# EAGLE design 16n-midijack (EAGLE 8.5.0)

## Sheet 1 of 2: Faders / Jacks / Digital
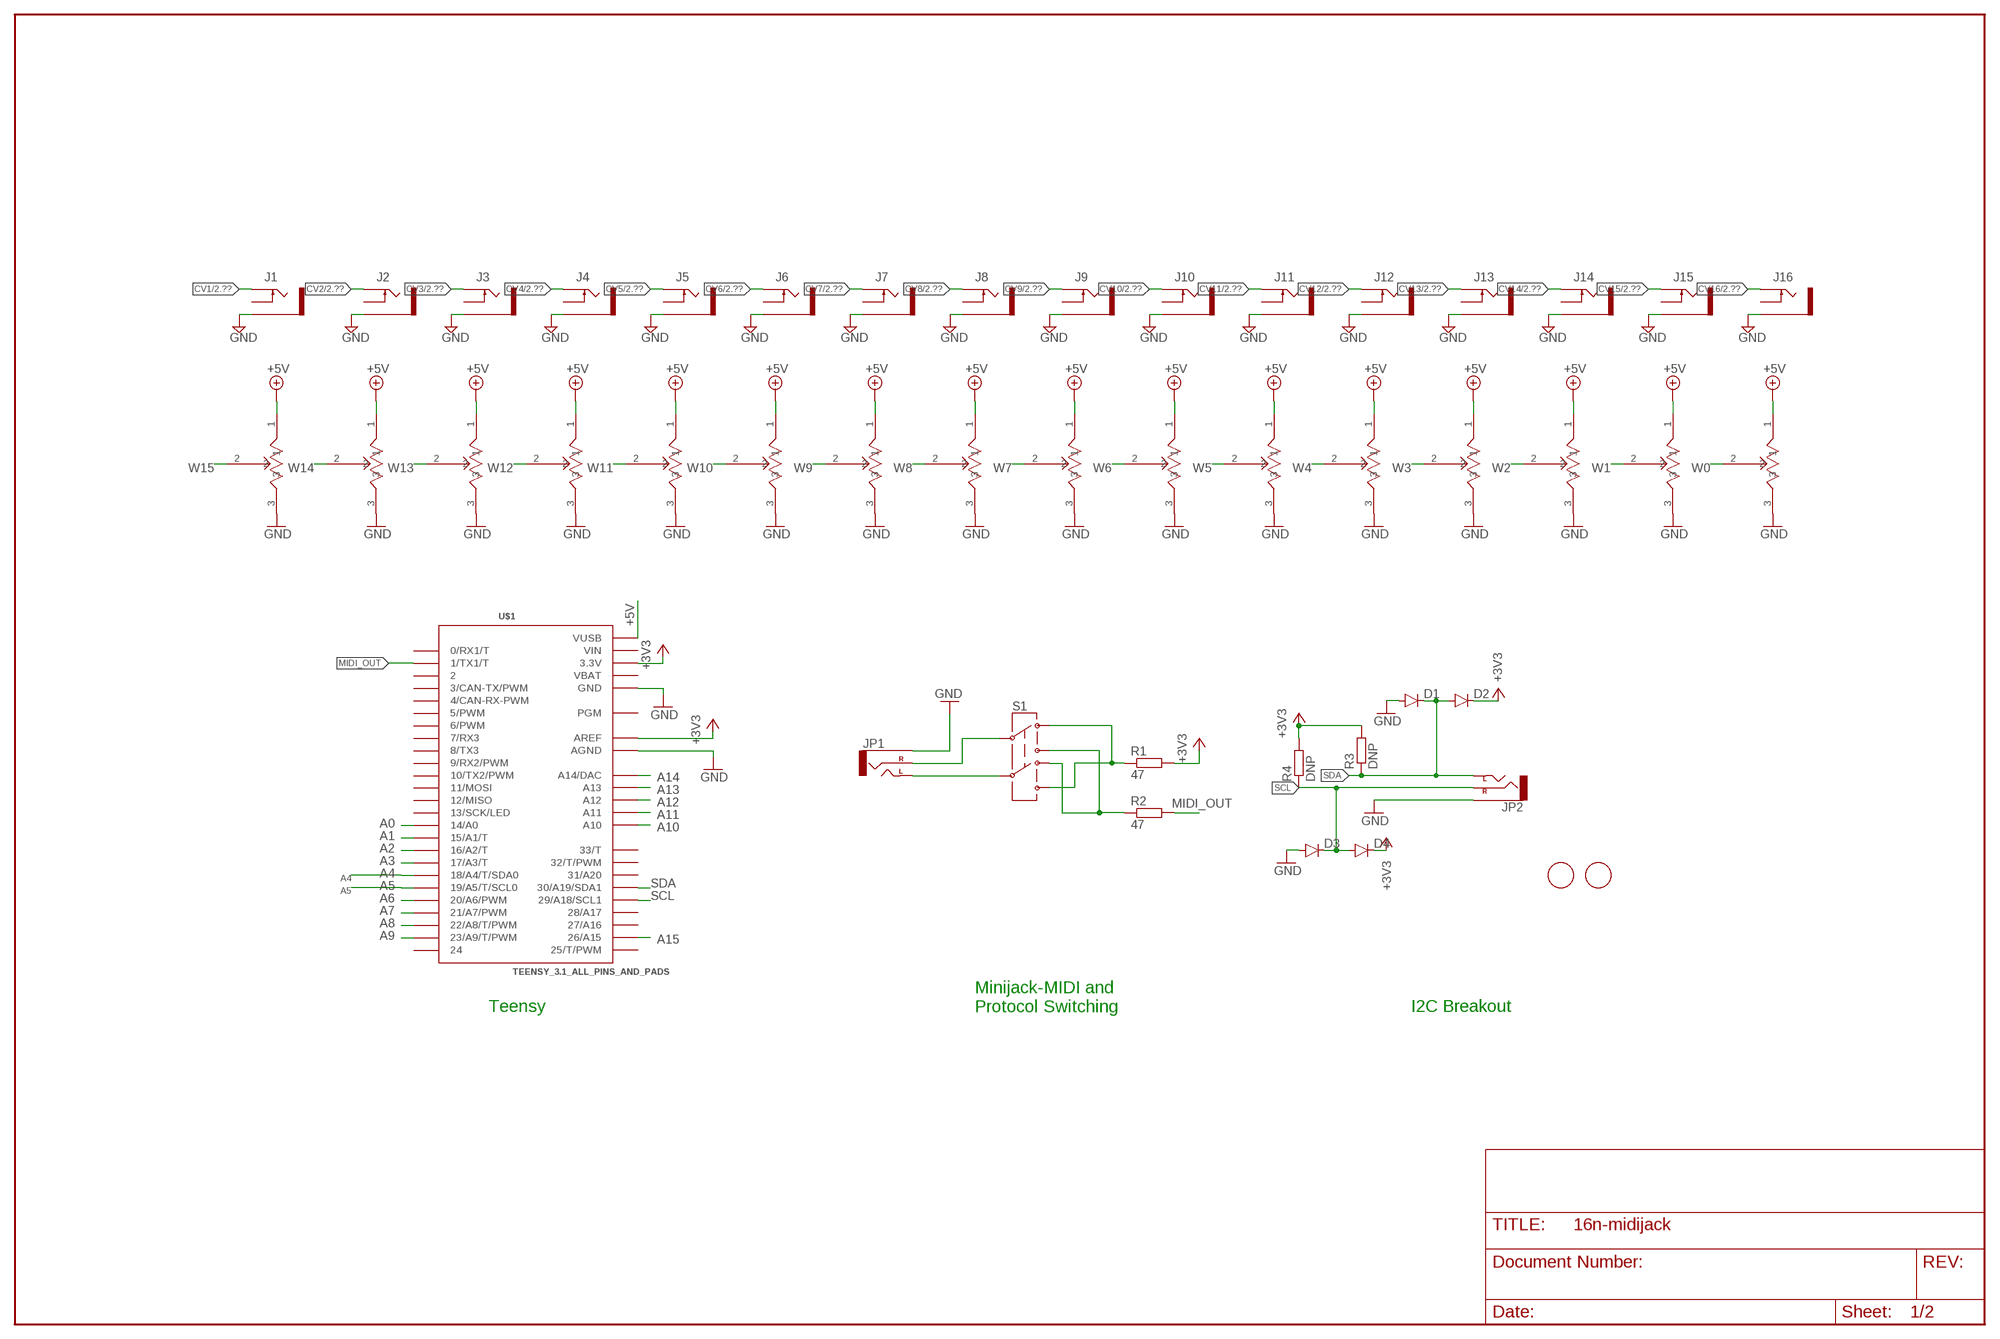
[diagram p0: schematic, sheet 1]

### Parts
D1  DIODESOD123  [SOD-123]
D2  DIODESOD123  [SOD-123]
D3  DIODESOD123  [SOD-123]
D4  DIODESOD123  [SOD-123]
FID1  FIDUCIAL  [FIDUCIAL_1MM]
FID2  FIDUCIAL  [FIDUCIAL_1MM]
J1  PJ302M  [PJ302M]
J2  PJ302M  [PJ302M]
J3  PJ302M  [PJ302M]
J4  PJ302M  [PJ302M]
J5  PJ302M  [PJ302M]
J6  PJ302M  [PJ302M]
J7  PJ302M  [PJ302M]
J8  PJ302M  [PJ302M]
J9  PJ302M  [PJ302M]
J10  PJ302M  [PJ302M]
J11  PJ302M  [PJ302M]
J12  PJ302M  [PJ302M]
J13  PJ302M  [PJ302M]
J14  PJ302M  [PJ302M]
J15  PJ302M  [PJ302M]
J16  PJ302M  [PJ302M]
JP1  AUDIO-JACKPTH  [AUDIO-JACK]
JP2  AUDIO-JACKPTH  [AUDIO-JACK]
R1  47  R-EU_R0805  [R0805]
R2  47  R-EU_R0805  [R0805]
R3  DNP  R-EU_R0805  [R0805]
R4  DNP  R-EU_R0805  [R0805]
S1  SWITCH-DPDTEG2211  [EG2211]
U$1  TEENSY_3.1_ALL_PINS_AND_PADS  [TEENSY_3.1_ALLPINS]
U$2  SLIDEPOT-ALPS-60MM  [RS6011SP600]
U$3  SLIDEPOT-ALPS-60MM  [RS6011SP600]
U$4  SLIDEPOT-ALPS-60MM  [RS6011SP600]
U$5  SLIDEPOT-ALPS-60MM  [RS6011SP600]
U$6  SLIDEPOT-ALPS-60MM  [RS6011SP600]
U$7  SLIDEPOT-ALPS-60MM  [RS6011SP600]
U$8  SLIDEPOT-ALPS-60MM  [RS6011SP600]
U$9  SLIDEPOT-ALPS-60MM  [RS6011SP600]
U$10  SLIDEPOT-ALPS-60MM  [RS6011SP600]
U$11  SLIDEPOT-ALPS-60MM  [RS6011SP600]
U$12  SLIDEPOT-ALPS-60MM  [RS6011SP600]
U$13  SLIDEPOT-ALPS-60MM  [RS6011SP600]
U$14  SLIDEPOT-ALPS-60MM  [RS6011SP600]
U$15  SLIDEPOT-ALPS-60MM  [RS6011SP600]
U$16  SLIDEPOT-ALPS-60MM  [RS6011SP600]
U$17  SLIDEPOT-ALPS-60MM  [RS6011SP600]

### Nets
+3V3: D2.C D4.C R1.2 R3.2 R4.2 U$1.3.3V U$1.3.3V1(3.3V) U$1.3.3V2(3.3V) U$1.AREF
+5V: U$1.VUSB U$2.1 U$3.1 U$4.1 U$5.1 U$6.1 U$7.1 U$8.1 U$9.1 U$10.1 U$11.1 U$12.1 U$13.1 U$14.1 U$15.1 U$16.1 U$17.1 ; also sheet 2
A0: U$1.14/A0 ; also sheet 2
A1: U$1.15/A1(15/A1/T) ; also sheet 2
A2: U$1.16/A2(16/A2/T) ; also sheet 2
A3: U$1.17/A3(17/A3/T) ; also sheet 2
A4: U$1.18/A4(18/A4/T/SDA0) ; also sheet 2
A5: U$1.19/A5(19/A5/T/SCL0) ; also sheet 2
A6: U$1.20/A6(20/A6/PWM) ; also sheet 2
A7: U$1.21/A7(21/A7/PWM) ; also sheet 2
A8: U$1.22/A8(22/A8/T/PWM) ; also sheet 2
A9: U$1.23/A9(23/A9/T/PWM) ; also sheet 2
A10: U$1.A10 ; also sheet 2
A11: U$1.A11 ; also sheet 2
A12: U$1.A12 ; also sheet 2
A13: U$1.A13 ; also sheet 2
A14: U$1.A14(A14/DAC) ; also sheet 2
A15: U$1.26(26/A15) ; also sheet 2
CV1: J1.TIP ; also sheet 2
CV2: J2.TIP ; also sheet 2
CV3: J3.TIP ; also sheet 2
CV4: J4.TIP ; also sheet 2
CV5: J5.TIP ; also sheet 2
CV6: J6.TIP ; also sheet 2
CV7: J7.TIP ; also sheet 2
CV8: J8.TIP ; also sheet 2
CV9: J9.TIP ; also sheet 2
CV10: J10.TIP ; also sheet 2
CV11: J11.TIP ; also sheet 2
CV12: J12.TIP ; also sheet 2
CV13: J13.TIP ; also sheet 2
CV14: J14.TIP ; also sheet 2
CV15: J15.TIP ; also sheet 2
CV16: J16.TIP ; also sheet 2
GND: D1.A D3.A J1.GND(SLEEVE) J2.GND(SLEEVE) J3.GND(SLEEVE) J4.GND(SLEEVE) J5.GND(SLEEVE) J6.GND(SLEEVE) J7.GND(SLEEVE) J8.GND(SLEEVE) J9.GND(SLEEVE) J10.GND(SLEEVE) J11.GND(SLEEVE) J12.GND(SLEEVE) J13.GND(SLEEVE) J14.GND(SLEEVE) J15.GND(SLEEVE) J16.GND(SLEEVE) JP1.SLEEVE JP2.SLEEVE U$1.AGND U$1.GND U$1.GND1(GND) U$1.GND2(GND) U$2.3 U$3.3 U$4.3 U$5.3 U$6.3 U$7.3 U$8.3 U$9.3 U$10.3 U$11.3 U$12.3 U$13.3 U$14.3 U$15.3 U$16.3 U$17.3 ; also sheet 2
MIDI_OUT: R2.2 U$1.1(1/TX1/T)
N$1: JP1.TIP(LEFT) S1.P2
N$2: JP1.RING(RIGHT) S1.P1
N$3: R2.1 S1.P1-TB S1.P2-TA
N$4: R1.1 S1.P1-TA S1.P2-TB
SCL: D3.C D4.A JP2.RING(RIGHT) R4.1 U$1.29(29/A18/SCL1)
SDA: D1.C D2.A JP2.TIP(LEFT) R3.1 U$1.30(30/A19/SDA1)
W0: U$17.2 ; also sheet 2
W1: U$16.2 ; also sheet 2
W2: U$15.2 ; also sheet 2
W3: U$14.2 ; also sheet 2
W4: U$13.2 ; also sheet 2
W5: U$12.2 ; also sheet 2
W6: U$11.2 ; also sheet 2
W7: U$10.2 ; also sheet 2
W8: U$9.2 ; also sheet 2
W9: U$8.2 ; also sheet 2
W10: U$7.2 ; also sheet 2
W11: U$6.2 ; also sheet 2
W12: U$5.2 ; also sheet 2
W13: U$4.2 ; also sheet 2
W14: U$3.2 ; also sheet 2
W15: U$2.2 ; also sheet 2
Unconnected: J1.SW(SWITCH) J2.SW(SWITCH) J3.SW(SWITCH) J4.SW(SWITCH) J5.SW(SWITCH) J6.SW(SWITCH) J7.SW(SWITCH) J8.SW(SWITCH) J9.SW(SWITCH) J10.SW(SWITCH) J11.SW(SWITCH) J12.SW(SWITCH) J13.SW(SWITCH) J14.SW(SWITCH) J15.SW(SWITCH) J16.SW(SWITCH) U$1.0(0/RX1/T) U$1.2 U$1.3(3/CAN-TX/PWM) U$1.4(4/CAN-RX-PWM) U$1.5(5/PWM) U$1.6(6/PWM) U$1.7(7/RX3) U$1.8(8/TX3) U$1.9(9/RX2/PWM) U$1.10(10/TX2/PWM) U$1.11(11/MOSI) U$1.12(12/MISO) U$1.13(13/SCK/LED) U$1.24 U$1.25(25/T/PWM) U$1.27(27/A16) U$1.28(28/A17) U$1.31(31/A20) U$1.32(32/T/PWM) U$1.33(33/T) U$1.PGM

### Notes on the sheet
- Teensy
- Minijack-MIDI and 
  Protocol Switching
- I2C Breakout

## Sheet 2 of 2: Buffers / OpAmp power
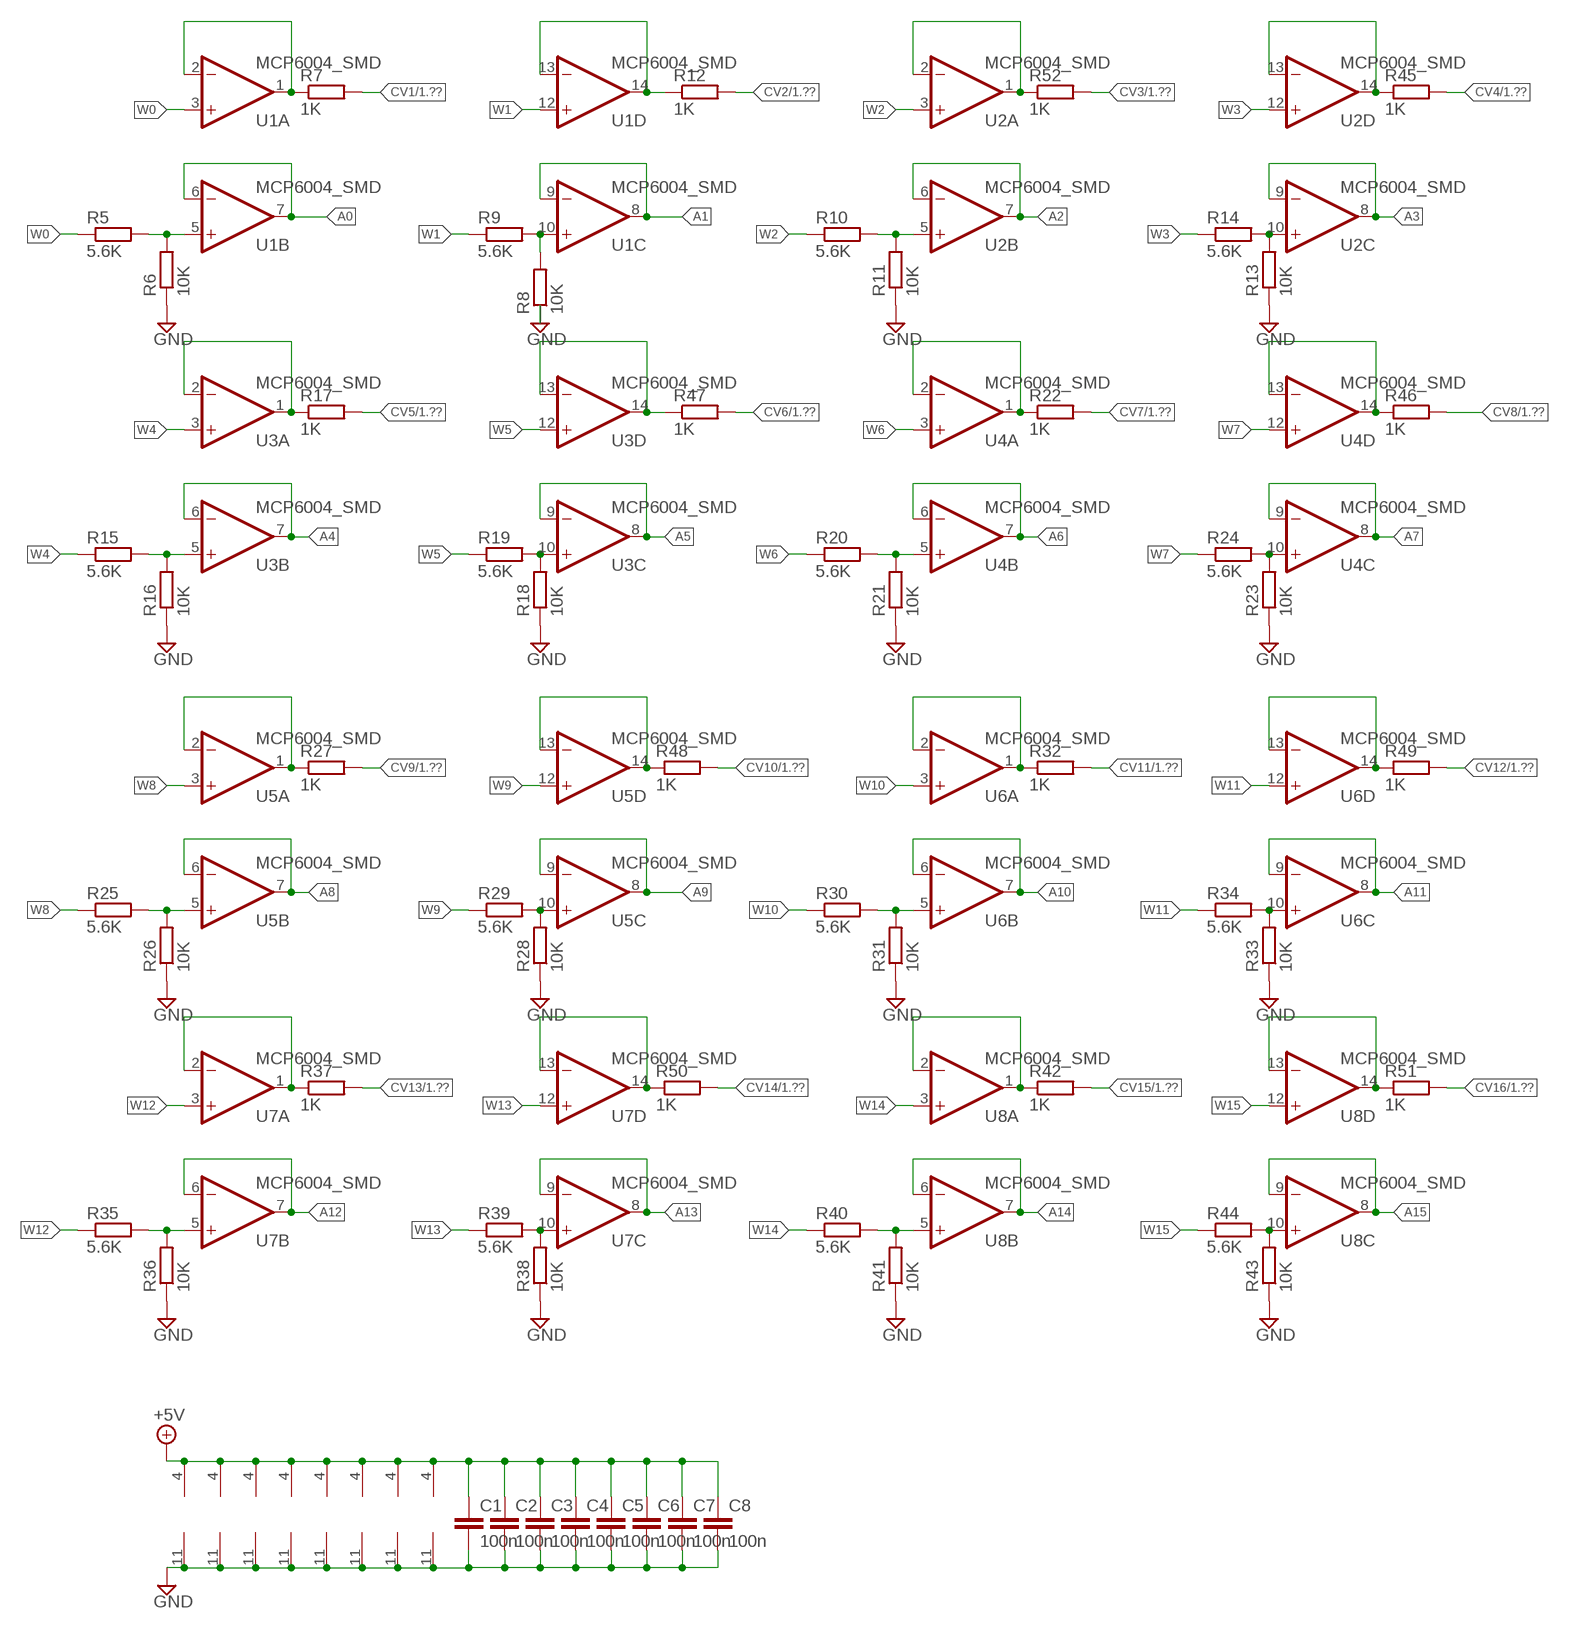
[diagram p1: schematic, sheet 2]

### Parts
C1  100n  C-EUC0805  [C0805]
C2  100n  C-EUC0805  [C0805]
C3  100n  C-EUC0805  [C0805]
C4  100n  C-EUC0805  [C0805]
C5  100n  C-EUC0805  [C0805]
C6  100n  C-EUC0805  [C0805]
C7  100n  C-EUC0805  [C0805]
C8  100n  C-EUC0805  [C0805]
R5  5.6K  R-EU_R0805  [R0805]
R6  10K  R-EU_R0805  [R0805]
R7  1K  R-EU_R0805  [R0805]
R8  10K  R-EU_R0805  [R0805]
R9  5.6K  R-EU_R0805  [R0805]
R10  5.6K  R-EU_R0805  [R0805]
R11  10K  R-EU_R0805  [R0805]
R12  1K  R-EU_R0805  [R0805]
R13  10K  R-EU_R0805  [R0805]
R14  5.6K  R-EU_R0805  [R0805]
R15  5.6K  R-EU_R0805  [R0805]
R16  10K  R-EU_R0805  [R0805]
R17  1K  R-EU_R0805  [R0805]
R18  10K  R-EU_R0805  [R0805]
R19  5.6K  R-EU_R0805  [R0805]
R20  5.6K  R-EU_R0805  [R0805]
R21  10K  R-EU_R0805  [R0805]
R22  1K  R-EU_R0805  [R0805]
R23  10K  R-EU_R0805  [R0805]
R24  5.6K  R-EU_R0805  [R0805]
R25  5.6K  R-EU_R0805  [R0805]
R26  10K  R-EU_R0805  [R0805]
R27  1K  R-EU_R0805  [R0805]
R28  10K  R-EU_R0805  [R0805]
R29  5.6K  R-EU_R0805  [R0805]
R30  5.6K  R-EU_R0805  [R0805]
R31  10K  R-EU_R0805  [R0805]
R32  1K  R-EU_R0805  [R0805]
R33  10K  R-EU_R0805  [R0805]
R34  5.6K  R-EU_R0805  [R0805]
R35  5.6K  R-EU_R0805  [R0805]
R36  10K  R-EU_R0805  [R0805]
R37  1K  R-EU_R0805  [R0805]
R38  10K  R-EU_R0805  [R0805]
R39  5.6K  R-EU_R0805  [R0805]
R40  5.6K  R-EU_R0805  [R0805]
R41  10K  R-EU_R0805  [R0805]
R42  1K  R-EU_R0805  [R0805]
R43  10K  R-EU_R0805  [R0805]
R44  5.6K  R-EU_R0805  [R0805]
R45  1K  R-EU_R0805  [R0805]
R46  1K  R-EU_R0805  [R0805]
R47  1K  R-EU_R0805  [R0805]
R48  1K  R-EU_R0805  [R0805]
R49  1K  R-EU_R0805  [R0805]
R50  1K  R-EU_R0805  [R0805]
R51  1K  R-EU_R0805  [R0805]
R52  1K  R-EU_R0805  [R0805]
U1  MCP6004_SMD  [SO14]
U2  MCP6004_SMD  [SO14]
U3  MCP6004_SMD  [SO14]
U4  MCP6004_SMD  [SO14]
U5  MCP6004_SMD  [SO14]
U6  MCP6004_SMD  [SO14]
U7  MCP6004_SMD  [SO14]
U8  MCP6004_SMD  [SO14]

### Nets
+5V: C1.1 C2.1 C3.1 C4.1 C5.1 C6.1 C7.1 C8.1 U1.4(P:V+) U2.4(P:V+) U3.4(P:V+) U4.4(P:V+) U5.4(P:V+) U6.4(P:V+) U7.4(P:V+) U8.4(P:V+) ; also sheet 1
A0: U1.6(B:-IN) U1.7(B:OUT) ; also sheet 1
A1: U1.8(C:OUT) U1.9(C:-IN) ; also sheet 1
A2: U2.6(B:-IN) U2.7(B:OUT) ; also sheet 1
A3: U2.8(C:OUT) U2.9(C:-IN) ; also sheet 1
A4: U3.6(B:-IN) U3.7(B:OUT) ; also sheet 1
A5: U3.8(C:OUT) U3.9(C:-IN) ; also sheet 1
A6: U4.6(B:-IN) U4.7(B:OUT) ; also sheet 1
A7: U4.8(C:OUT) U4.9(C:-IN) ; also sheet 1
A8: U5.6(B:-IN) U5.7(B:OUT) ; also sheet 1
A9: U5.8(C:OUT) U5.9(C:-IN) ; also sheet 1
A10: U6.6(B:-IN) U6.7(B:OUT) ; also sheet 1
A11: U6.8(C:OUT) U6.9(C:-IN) ; also sheet 1
A12: U7.6(B:-IN) U7.7(B:OUT) ; also sheet 1
A13: U7.8(C:OUT) U7.9(C:-IN) ; also sheet 1
A14: U8.6(B:-IN) U8.7(B:OUT) ; also sheet 1
A15: U8.8(C:OUT) U8.9(C:-IN) ; also sheet 1
CV1: R7.2 ; also sheet 1
CV2: R12.2 ; also sheet 1
CV3: R52.2 ; also sheet 1
CV4: R45.2 ; also sheet 1
CV5: R17.2 ; also sheet 1
CV6: R47.2 ; also sheet 1
CV7: R22.2 ; also sheet 1
CV8: R46.2 ; also sheet 1
CV9: R27.2 ; also sheet 1
CV10: R48.2 ; also sheet 1
CV11: R32.2 ; also sheet 1
CV12: R49.2 ; also sheet 1
CV13: R37.2 ; also sheet 1
CV14: R50.2 ; also sheet 1
CV15: R42.2 ; also sheet 1
CV16: R51.2 ; also sheet 1
GND: C1.2 C2.2 C3.2 C4.2 C5.2 C6.2 C7.2 C8.2 R6.1 R8.1 R11.1 R13.1 R16.1 R18.1 R21.1 R23.1 R26.1 R28.1 R31.1 R33.1 R36.1 R38.1 R41.1 R43.1 U1.11(P:V-) U2.11(P:V-) U3.11(P:V-) U4.11(P:V-) U5.11(P:V-) U6.11(P:V-) U7.11(P:V-) U8.11(P:V-) ; also sheet 1
N$6: R10.2 R11.2 U2.5(B:+IN)
N$7: R13.2 R14.2 U2.10(C:+IN)
N$9: R5.2 R6.2 U1.5(B:+IN)
N$10: R8.2 R9.2 U1.10(C:+IN)
N$12: R15.2 R16.2 U3.5(B:+IN)
N$13: R18.2 R19.2 U3.10(C:+IN)
N$15: R20.2 R21.2 U4.5(B:+IN)
N$16: R23.2 R24.2 U4.10(C:+IN)
N$18: R25.2 R26.2 U5.5(B:+IN)
N$19: R28.2 R29.2 U5.10(C:+IN)
N$21: R30.2 R31.2 U6.5(B:+IN)
N$22: R33.2 R34.2 U6.10(C:+IN)
N$24: R35.2 R36.2 U7.5(B:+IN)
N$25: R38.2 R39.2 U7.10(C:+IN)
N$27: R40.2 R41.2 U8.5(B:+IN)
N$28: R43.2 R44.2 U8.10(C:+IN)
N$300: R7.1 U1.1(A:OUT) U1.2(A:-IN)
N$301: R12.1 U1.13(D:-IN) U1.14(D:OUT)
N$302: R52.1 U2.1(A:OUT) U2.2(A:-IN)
N$303: R45.1 U2.13(D:-IN) U2.14(D:OUT)
N$304: R17.1 U3.1(A:OUT) U3.2(A:-IN)
N$305: R47.1 U3.13(D:-IN) U3.14(D:OUT)
N$306: R22.1 U4.1(A:OUT) U4.2(A:-IN)
N$307: R46.1 U4.13(D:-IN) U4.14(D:OUT)
N$308: R27.1 U5.1(A:OUT) U5.2(A:-IN)
N$309: R48.1 U5.13(D:-IN) U5.14(D:OUT)
N$310: R32.1 U6.1(A:OUT) U6.2(A:-IN)
N$311: R49.1 U6.13(D:-IN) U6.14(D:OUT)
N$312: R37.1 U7.1(A:OUT) U7.2(A:-IN)
N$313: R50.1 U7.13(D:-IN) U7.14(D:OUT)
N$314: R42.1 U8.1(A:OUT) U8.2(A:-IN)
N$315: R51.1 U8.13(D:-IN) U8.14(D:OUT)
W0: R5.1 U1.3(A:+IN) ; also sheet 1
W1: R9.1 U1.12(D:+IN) ; also sheet 1
W2: R10.1 U2.3(A:+IN) ; also sheet 1
W3: R14.1 U2.12(D:+IN) ; also sheet 1
W4: R15.1 U3.3(A:+IN) ; also sheet 1
W5: R19.1 U3.12(D:+IN) ; also sheet 1
W6: R20.1 U4.3(A:+IN) ; also sheet 1
W7: R24.1 U4.12(D:+IN) ; also sheet 1
W8: R25.1 U5.3(A:+IN) ; also sheet 1
W9: R29.1 U5.12(D:+IN) ; also sheet 1
W10: R30.1 U6.3(A:+IN) ; also sheet 1
W11: R34.1 U6.12(D:+IN) ; also sheet 1
W12: R35.1 U7.3(A:+IN) ; also sheet 1
W13: R39.1 U7.12(D:+IN) ; also sheet 1
W14: R40.1 U8.3(A:+IN) ; also sheet 1
W15: R44.1 U8.12(D:+IN) ; also sheet 1

## Power pins joined to a net without a drawn wire
VBAT: U$1.VBAT
VIN: U$1.VIN

## Library data of the parts
C1-C8 = rcl:C-EU: CAPACITOR, European symbol
D1-D4 = foxfield:DIODE
FID1 FID2 = adafruit:FIDUCIAL: For use by pick and place machines to calibrate the vision/machine, 1mm By microbuilder.eu
J1-J16 = pj302m:PJ302M: PJ302M horizontal / right angled mount 3.5 mm jack socket
JP1 JP2 = SparkFun-Connectors:AUDIO-JACK: 3.5mm Audio Jack Simple 3.5mm common PCB mount audio jack. Variant PTH is our storefront SKU PRT-08032
R1-R52 = rcl:R-EU_: RESISTOR, European symbol
S1 = SparkFun-Electromechanical:SWITCH-DPDT: DPDT Version of the COM-00597
U1-U8 = MusicThingModular:MCP6004: Generic Quad Op Amp
U$1 = Teensy_3_Series_Board_v1.0:TEENSY_3.1_ALL_PINS_AND_PADS: Footprint for Teensy 3.1 board using all pads and all through-holes. Pads need a 2x7 0.1" SMD header.
U$2-U$17 = monome:SLIDEPOT-ALPS-60MM

## Board
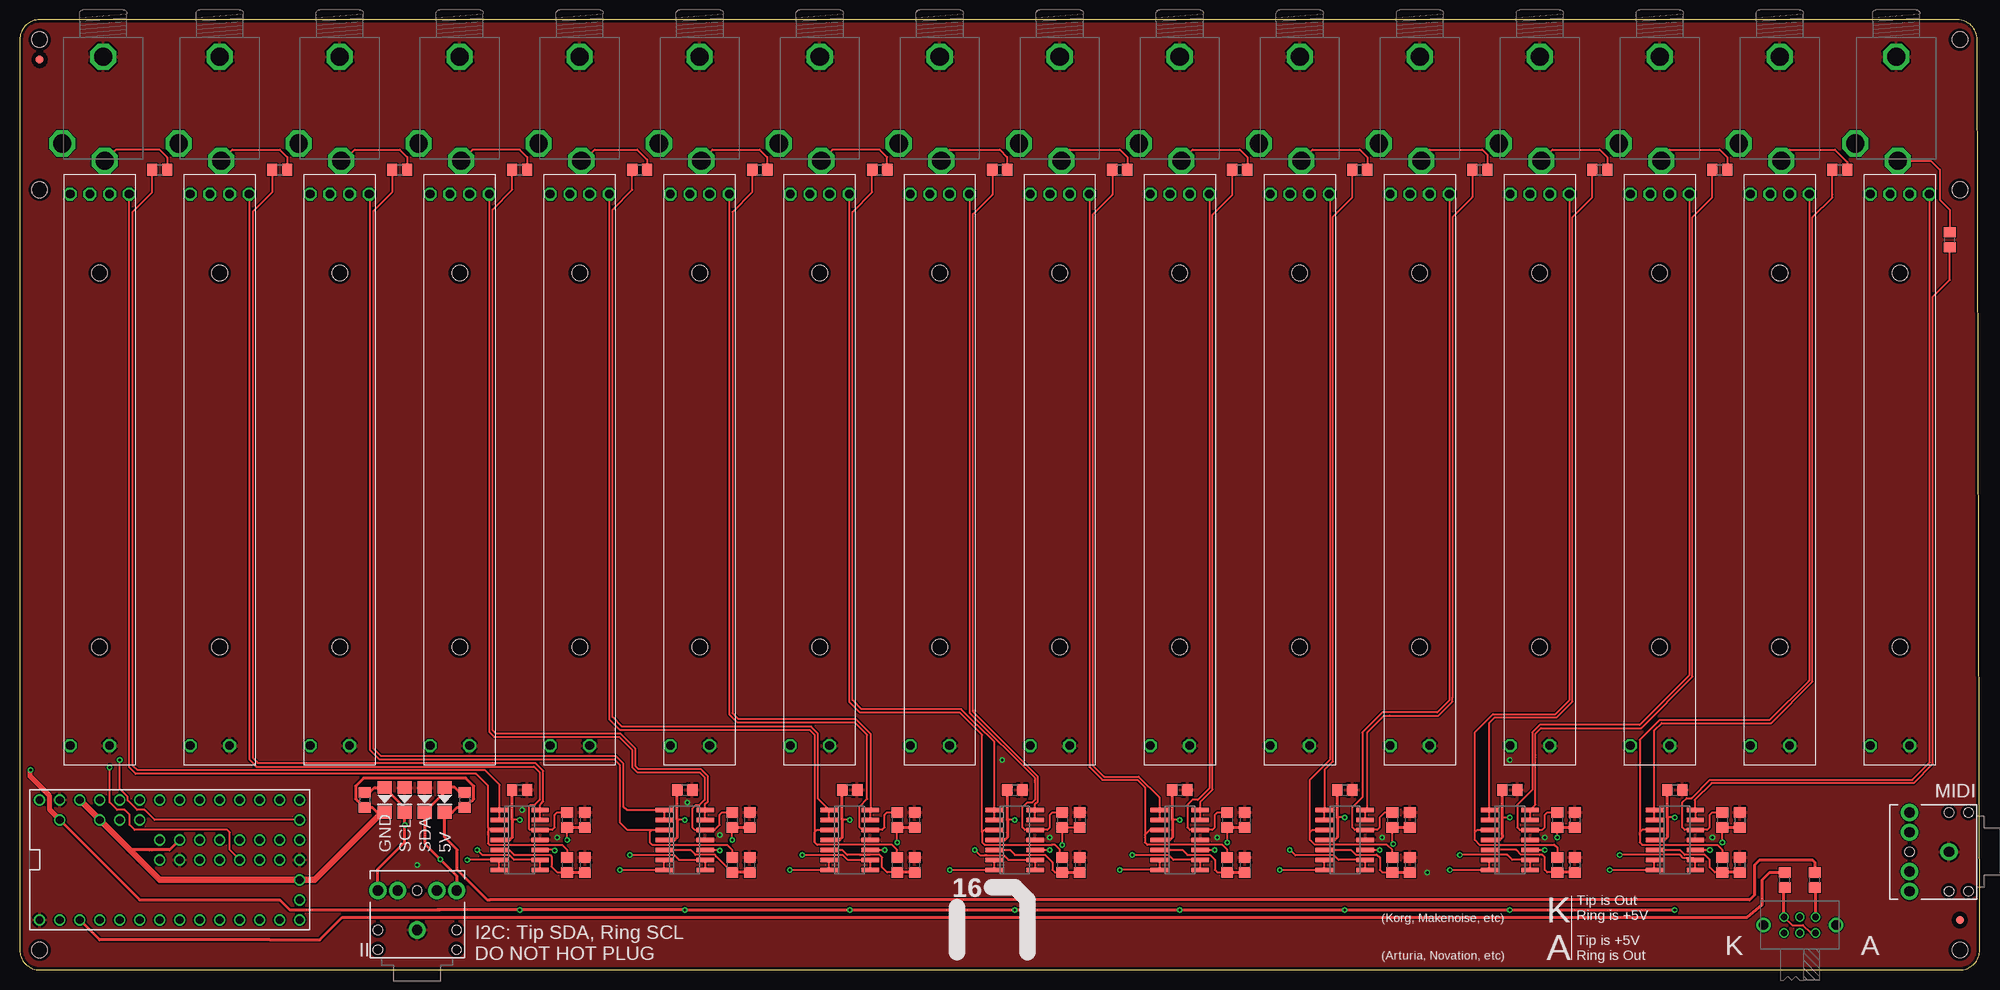
[diagram p2: board, top side]
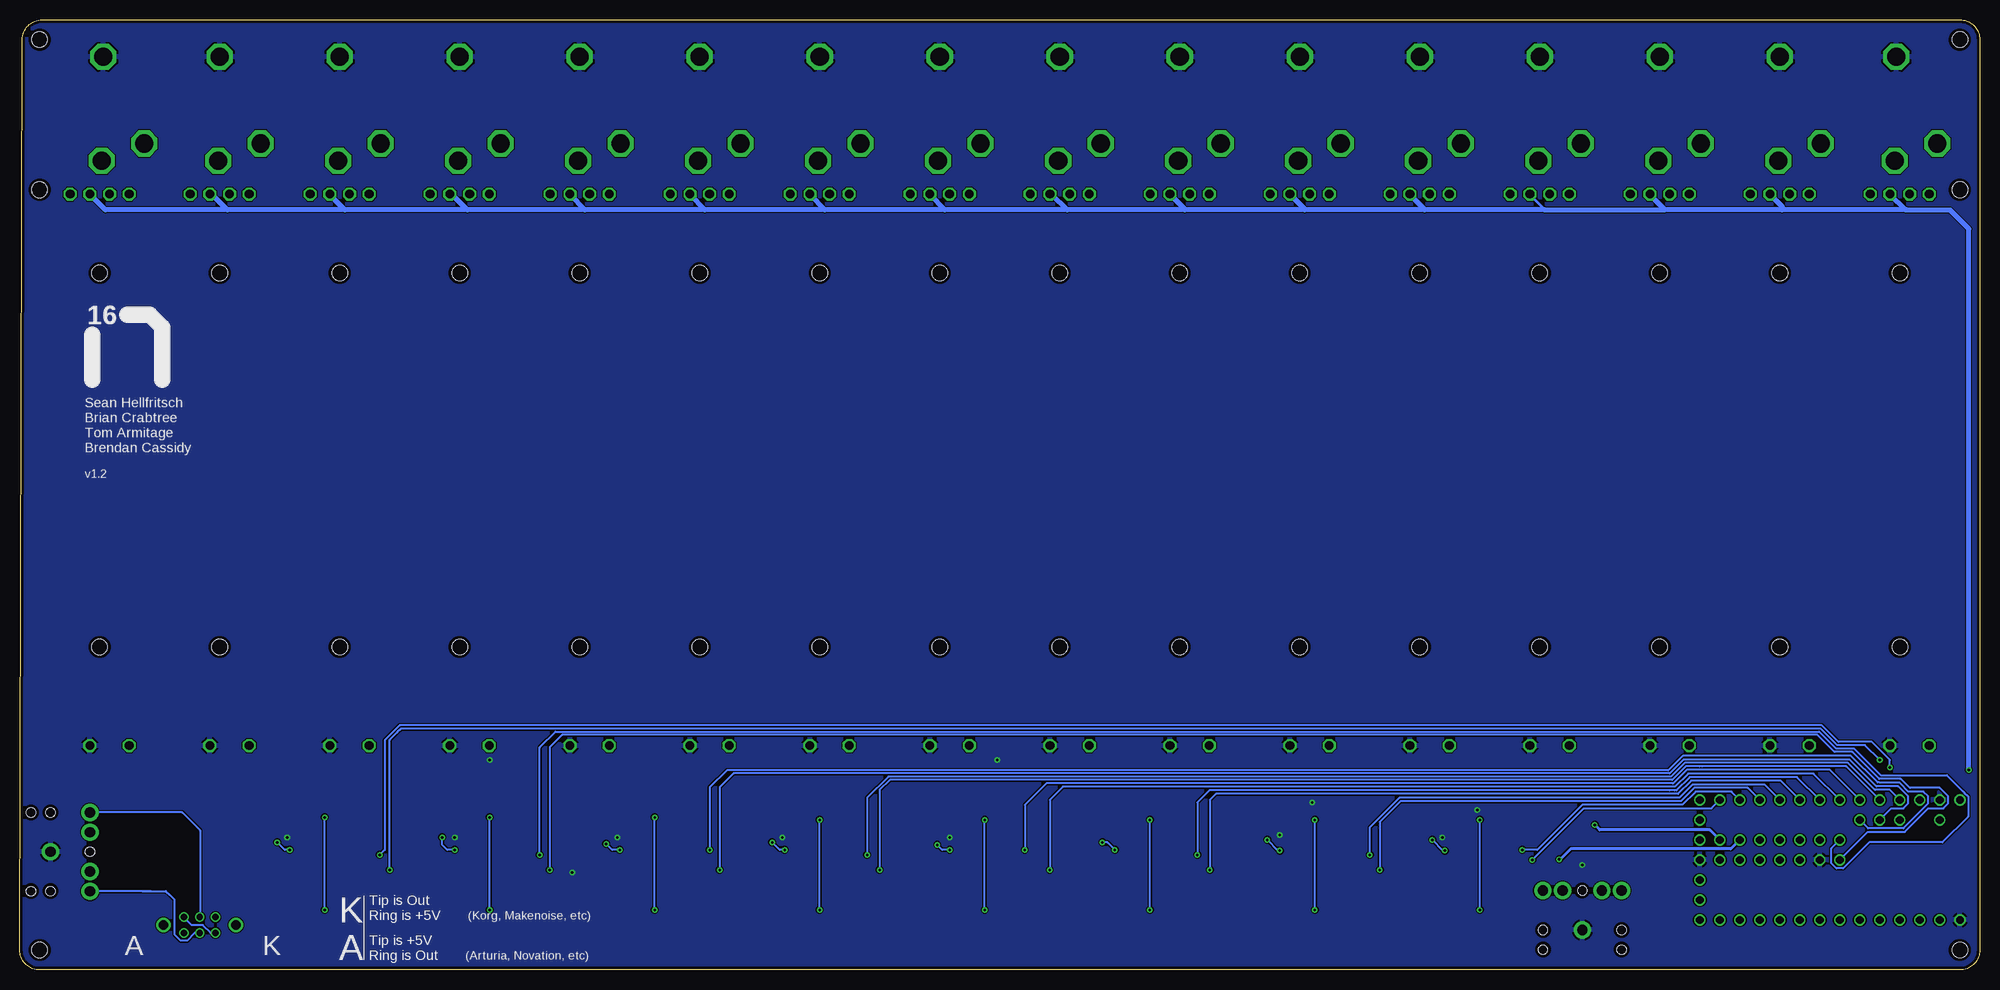
[diagram p3: board, bottom side, seen from below]

Size 248.92 x 120.65 mm. Coordinates in mm from the lower left corner, seen from the top.
Outline: 2.54,0 246.38,0 arc90 248.92,2.54 248.61,118.12 arc90 246.07,120.65 2.54,120.65 arc90 0,118.11 0,2.54 arc90 2.54,0
Copper layers (1*16): Top 0.0356mm / dielectric 1.5011mm / Bottom 0.0356mm
Design rules "oshpark-2layer": minimum track width 6mil, minimum drill 13mil, track to track 6mil, track to pad 6mil, pad to pad 6mil, via to via 6mil, smd to smd 6mil, copper to edge 15mil, drill to drill 6mil, minimum pad ring 7mil, minimum via ring 7mil, stop-mask expansion 2.5mil, vias tented up to drill 0mil, thermal gap 10mil
Holes 2 mm at 2.54,2.54 246.38,99.06 246.38,2.54 2.54,99.06 2.54,118.11 246.38,118.11

### Footprints (pad centres in the part's own frame; a part is rotated, then mirrored left to right if it is on the bottom)
C0805 = smd 1.3 x 1.5: 1 -0.95,0; 2 0.95,0
SOD-123 = smd 1.6 x 1.8: A 1.575,0; C -1.575,0
FIDUCIAL_1MM = smd 1 x 1: 1 0,0
PJ302M = drill 2.3 pad 3.3 octagon: GND 2.5,0; SW 13.5,-5.2; TIP 15.7,0.2
AUDIO-JACK = drill 1.3 pad 2.184: RING 5,5; RSH 5,2.5; SLEEVE 0,0; TIP 5,-5; TSH 5,-2.5 | hole 1.2: 0,5; -2.5,5; -2.5,-5; 0,-5; 5,0
R0805 = smd 1.3 x 1.5: 1 -0.95,0; 2 0.95,0
EG2211 = drill 0.8: P1 -1,0; P1-TA -1,2; P1-TB -1,-2; P2 1,0; P2-TA 1,2; P2-TB 1,-2 | drill 1.2: P$7 0,4.6; P$8 0,-4.6
SO14 = smd 0.6 x 2.2: 1 -3.81,-2.6; 2 -2.54,-2.6; 3 -1.27,-2.6; 4 0,-2.6; 5 1.27,-2.6; 6 2.54,-2.6; 7 3.81,-2.6; 8 3.81,2.6; 9 2.54,2.6; 10 1.27,2.6; 11 0,2.6; 12 -1.27,2.6; 13 -2.54,2.6; 14 -3.81,2.6
TEENSY_3.1_ALLPINS = drill 0.965: 0 -7.62,15.24; 1 -7.62,12.7; 2 -7.62,10.16; 3 -7.62,7.62; 3.3V 7.62,12.7; 3.3V1 -2.54,-15.24; 3.3V2 2.54,0; 4 -7.62,5.08; 5 -7.62,2.54; 6 -7.62,0; 7 -7.62,-2.54; 8 -7.62,-5.08; 9 -7.62,-7.62; 10 -7.62,-10.16; 11 -7.62,-12.7; 12 -7.62,-15.24; 13 7.62,-15.24; 14/A0 7.62,-12.7; 15/A1 7.62,-10.16; 16/A2 7.62,-7.62; 17/A3 7.62,-5.08; 18/A4 7.62,-2.54; 19/A5 7.62,0; 20/A6 7.62,2.54; 21/A7 7.62,5.08; 22/A8 7.62,7.62; 23/A9 7.62,10.16; 24 0,-2.54; 25 0,-5.08; 26 0,-7.62; 27 0,-10.16; 28 0,-12.7; 29 2.54,-12.7; 30 2.54,-10.16; 31 2.54,-7.62; 32 2.54,-5.08; 33 2.54,-2.54; A10 5.08,7.62; A11 5.08,5.08; A12 0,2.54; A13 2.54,2.54; A14 5.08,-15.24; AGND 7.62,15.24; AREF 5.08,10.16; GND -7.62,17.78; GND1 0,-15.24; GND2 0,0; PGM 2.54,-15.24; VBAT -5.08,-15.24; VIN 7.62,17.78; VUSB 5.08,15.24
RS6011SP600 = drill 1.1 octagon: 1 -35,1.25; 2 -35,3.75; 3 35,1.25; L1 35,-3.75; L2 -35,-3.75; L3 -35,-1.25 | hole 2: -25,0; 22.5,0

### Placement (x,y rotation side)
C1  63.5,22.86 0 top
C2  84.45,22.86 0 top
C3  105.41,22.86 0 top
C4  126.36,22.86 0 top
C5  147.32,22.86 0 top
C6  168.28,22.86 0 top
C7  189.23,22.86 0 top
C8  210.19,22.86 0 top
D1  51.44,21.59 90 top
D2  53.98,21.59 90 top
D3  48.9,21.59 90 top
D4  46.35,21.59 90 top
FID1  2.54,115.57 0 top
FID2  246.38,6.35 0 top
J1  10.6,118.43 270 top
J2  25.4,118.43 270 top
J3  40.64,118.43 270 top
J4  55.88,118.43 270 top
J5  71.12,118.43 270 top
J6  86.36,118.43 270 top
J7  101.6,118.43 270 top
J8  116.84,118.43 270 top
J9  132.08,118.43 270 top
J10  147.32,118.43 270 top
J11  162.56,118.43 270 top
J12  177.8,118.43 270 top
J13  193.04,118.43 270 top
J14  208.28,118.43 270 top
J15  223.52,118.43 270 top
J16  238.3,118.43 270 top
JP1  245,15 180 top
JP2  50.48,5.08 90 top
R1  227.97,11.43 90 top
R2  224.16,11.43 90 top
R3  56.52,21.59 270 top
R4  43.81,21.59 270 top
R5  69.53,13.34 270 top
R6  71.78,13.34 270 top
R7  17.78,101.6 0 top
R8  71.78,19.05 270 top
R9  69.53,19.05 270 top
R10  90.49,13.34 270 top
R11  92.71,13.34 270 top
R12  33.02,101.6 0 top
R13  92.71,19.05 270 top
R14  90.49,19.05 270 top
R15  111.44,13.34 270 top
R16  113.67,13.34 270 top
R17  78.74,101.6 0 top
R18  113.67,19.05 270 top
R19  111.44,19.05 270 top
R20  132.4,13.34 270 top
R21  134.62,13.34 270 top
R22  109.22,101.6 0 top
R23  134.62,19.05 270 top
R24  132.4,19.05 270 top
R25  153.35,13.34 270 top
R26  155.57,13.34 270 top
R27  139.7,101.6 0 top
R28  155.57,19.05 270 top
R29  153.35,19.05 270 top
R30  174.31,13.34 270 top
R31  176.53,13.34 270 top
R32  170.18,101.6 0 top
R33  176.53,19.05 270 top
R34  174.31,19.05 270 top
R35  195.26,13.34 270 top
R36  197.49,13.34 270 top
R37  200.66,101.6 0 top
R38  197.49,19.05 270 top
R39  195.26,19.05 270 top
R40  216.22,13.34 270 top
R41  218.44,13.34 270 top
R42  231.14,101.6 0 top
R43  218.44,19.05 270 top
R44  216.22,19.05 270 top
R45  63.5,101.6 0 top
R46  124.46,101.6 0 top
R47  93.98,101.6 0 top
R48  154.94,101.6 0 top
R49  185.42,101.6 0 top
R50  215.9,101.6 0 top
R51  245.11,92.71 90 top
R52  48.26,101.6 0 top
S1  226.06,5.71 90 top
U1  63.5,16.51 270 top
U2  84.45,16.51 270 top
U3  105.41,16.51 270 top
U4  126.36,16.51 270 top
U5  147.32,16.51 270 top
U6  168.28,16.51 270 top
U7  189.23,16.51 270 top
U8  210.19,16.51 270 top
U$1  20.32,13.97 90 top
U$2  238.76,63.5 270 top
U$3  223.52,63.5 270 top
U$4  208.28,63.5 270 top
U$5  193.04,63.5 270 top
U$6  177.8,63.5 270 top
U$7  162.56,63.5 270 top
U$8  147.32,63.5 270 top
U$9  132.08,63.5 270 top
U$10  116.84,63.5 270 top
U$11  101.6,63.5 270 top
U$12  86.36,63.5 270 top
U$13  71.12,63.5 270 top
U$14  55.88,63.5 270 top
U$15  40.64,63.5 270 top
U$16  25.4,63.5 270 top
U$17  10.16,63.5 270 top

### Tracks (layer width: path | path; a pad name or v marks a point on that pad's centre or on a via)
+3V3
  Top 0.406: U$1.3.3V2 19.05,15.24 16.83,15.24 | 16.83,15.24 16.51,15.24 | 44.77,20.64 R4.2 42.97,21.48 42.9,21.48 42.66,21.72 42.66,23.36 43.67,24.37 56.66,24.37 57.67,23.36 57.67,21.72 57.43,21.48 57.36,21.48 R3.2 55.56,20.64 54.94,20.02 D2.C 53.98,16.83 55.56,15.24 55.56,12.7 59.37,8.89 59.69,8.89 219.71,8.89 220.34,9.53 220.34,13.34 220.98,13.97 227.65,13.97 227.97,13.65 R1.2 | 45.09,20.32 44.77,20.64 | D4.C 46.04,20.02 45.39,20.02 44.77,20.64 | 16.83,15.24 13.97,15.24
  Top 0.813: U$1.3.3V U$1.AREF 13.97,15.24 15.24,13.97 17.78,11.43 U$1.3.3V1 37.47,11.43 46.04,20 46.04,20.02
+5V  (via drill 0.35)
  Top 0.254: v63.5,19.05 62.55,19.05 | v84.45,19.05 83.5,19.05 | v105.41,19.05 104.46,19.05 | v126.36,19.05 125.42,19.05 | v147.32,19.05 146.37,19.05 | v168.28,19.37 167.32,19.37 | 188.28,19.37 v189.23,19.37 | v210.19,19.37 209.24,19.37
  Top 0.406: U$1.VUSB 15.24,8.89 33.02,8.89 34.29,7.62 53.02,7.62 | 53.02,7.62 53.34,7.62 | C1.1 62.55,19.05 62.55,17.14 62.55,16.83 62.23,16.51 U1.4 | C2.1 83.5,19.05 83.5,17.78 83.5,16.83 83.19,16.51 U2.4 | C3.1 104.46,19.05 104.46,17.46 104.46,16.83 104.14,16.51 U3.4 | C4.1 125.42,19.05 125.42,17.46 125.42,16.83 125.09,16.51 U4.4 | C5.1 146.37,19.05 146.37,17.78 146.37,16.83 146.05,16.51 U5.4 | C6.1 167.32,19.37 167.32,16.83 167,16.51 U6.4 | C7.1 188.28,19.37 188.28,17.14 188.28,16.83 187.96,16.51 U7.4 | C8.1 209.24,19.37 209.24,17.14 209.24,16.83 208.91,16.51 U8.4 | v210.19,7.62 v189.23,7.62 v168.28,7.62 v147.32,7.62 v126.36,7.62 v105.41,7.62 v84.45,7.62 v63.5,7.62 53.02,7.62
  Top 0.61: U$1.VUSB 3.79,20.34 3.79,22.11 1.32,24.57 1.32,25.4 v1.39,25.4
  Bottom 0.254: v63.5,7.62 v63.5,19.05 | v84.45,7.62 v84.45,19.05 | v105.41,7.62 v105.41,19.05 | v126.36,7.62 v126.36,19.05 | v147.32,7.62 v147.32,19.05 | v168.28,7.62 v168.28,19.37 | v189.23,7.62 189.23,19.05 v189.23,19.37 | v210.19,7.62 v210.19,19.37
  Bottom 0.406: U$14.1 57.13,98.41 55.24,96.52
  Bottom 0.61: v1.39,25.4 1.39,94.1 3.81,96.52 9.21,96.52 | 207.65,96.52 222.57,96.52 | 192.09,96.52 207.65,96.52 | 177.16,96.52 192.09,96.52 | 161.93,96.52 177.16,96.52 | 146.69,96.52 161.93,96.52 | 131.44,96.52 146.69,96.52 | 115.89,96.52 131.44,96.52 | 100.97,96.52 115.89,96.52 | 85.72,96.52 100.97,96.52 | 70.48,96.52 85.72,96.52 | 40.01,96.52 55.24,96.52 70.48,96.52 | 25.08,96.52 40.01,96.52 | 9.21,96.52 25.08,96.52 | 222.57,96.52 238.03,96.52 U$2.1 | U$3.1 224.55,98.5 222.57,96.52 | U$4.1 209.53,98.41 207.65,96.52 | U$5.1 194.07,98.5 192.09,96.52 | U$6.1 179.05,98.41 177.16,96.52 | U$7.1 163.81,98.41 161.93,96.52 | U$8.1 148.57,98.41 146.69,96.52 | U$9.1 133.33,98.41 131.44,96.52 | U$10.1 117.87,98.5 115.89,96.52 | U$11.1 100.97,96.61 100.97,96.52 | U$12.1 85.72,96.61 85.72,96.52 | U$13.1 72.37,98.41 70.48,96.52 | U$15.1 41.89,98.41 40.01,96.52 | U$16.1 25.08,96.93 25.08,96.52 | U$17.1 9.43,96.52 9.21,96.52
A0  (via drill 0.35)
  Top 0.254: v56.83,13.97 U1.6 U1.7
  Bottom 0.254: v56.83,13.97 50.28,20.52 34.09,20.52 U$1.14/A0
A1  (via drill 0.35)
  Top 0.254: v58.1,15.24 58.74,14.6 62.14,14.6 62.77,13.97 U1.9 U1.8
  Bottom 0.254: v58.1,15.24 56.21,15.24 50.47,20.98 37.76,20.98 36.08,22.66 31.55,22.66 U$1.15/A1
A2  (via drill 0.35)
  Top 0.254: v76.2,12.7 U2.7 U2.6
  Bottom 0.254: 76.2,18.41 76.2,18 | 76.2,18 v76.2,12.7 | 76.2,18 76.2,18.79 73.56,21.44 37.95,21.44 36.27,23.11 29.46,23.11 U$1.16/A2
A3  (via drill 0.35)
  Top 0.254: v77.47,14.61 v77.47,14.6 83.09,14.6 83.72,13.97 U2.9 U2.8
  Bottom 0.254: v77.47,14.61 77.47,18.1 73.78,21.78 73.67,21.89 38.14,21.89 36.46,23.57 27.38,23.57 U$1.17/A3
A4  (via drill 0.35)
  Top 0.254: U3.6 U3.7 v97.79,12.7
  Bottom 0.254: v97.79,12.7 97.79,21.59 97.03,22.35 38.33,22.35 36.65,24.03 25.3,24.03 U$1.18/A4
A5  (via drill 0.35)
  Top 0.254: U3.8 U3.9 105.15,13.97 104.52,14.61 v99.38,14.61
  Bottom 0.254: U$1.19/A5 23.22,24.49 28.57,24.49 36.84,24.49 38.52,22.81 38.73,22.81 | 38.73,22.81 39.37,22.81 | 38.73,22.81 97.84,22.81 99.38,21.27 v99.38,14.61
A6  (via drill 0.35)
  Top 0.254: U4.6 U4.7 v118.11,12.7
  Bottom 0.254: v118.11,12.7 118.11,21.59 116.43,23.27 38.7,23.27 37.03,24.94 21.13,24.94 U$1.20/A6
A7  (via drill 0.35)
  Top 0.254: U4.8 U4.9 125.56,13.97 124.98,14.55 122.87,14.55 | 122.87,14.55 122.55,14.55 | 122.87,14.55 121.98,14.55 v121.28,15.24
  Bottom 0.254: 39.05,23.72 38.89,23.72 | 38.89,23.72 37.22,25.4 19.05,25.4 U$1.21/A7 | 38.89,23.72 118.52,23.72 121.28,20.95 v121.28,15.24
A8  (via drill 0.35)
  Top 0.254: U5.6 U5.7 v139.7,12.7
  Bottom 0.254: U$1.22/A8 16.97,25.86 35.24,25.86 | 35.24,25.86 35.56,25.86 | 35.24,25.86 37.34,25.86 39.06,24.14 138.43,24.14 139.7,22.86 v139.7,12.7
A9  (via drill 0.35)
  Top 0.254: U5.8 U5.9 146.51,13.97 145.94,14.55 141.34,14.55 v141.29,14.61
  Bottom 0.254: U$1.23/A9 11.43,22.86 13.32,22.86 16.78,26.31 37.45,26.31 39.23,24.54 138.59,24.54 141.29,21.85 v141.29,14.61
A10  (via drill 0.35)
  Top 0.254: U6.6 U6.7 v160.02,12.7
  Bottom 0.254: U$1.A10 11.23,20.52 9.72,20.52 9.09,21.15 9.09,22.03 10.38,23.32 13.13,23.32 16.54,26.72 37.62,26.72 39.39,24.95 158.25,24.95 160.02,23.18 v160.02,12.7
A11  (via drill 0.35)
  Top 0.254: U6.8 U6.9 167.47,13.97 166.89,14.55 161.98,14.55 v161.29,15.24
  Bottom 0.254: v161.29,15.24 161.29,23.18 159.11,25.35 39.56,25.35 37.69,27.23 16.4,27.23 12.98,23.81 12.74,23.81 12.7,23.77 10.19,23.77 9.07,22.66 7.18,22.66 6.55,22.03 6.55,21.15 9.72,17.98 14.17,17.98 U$1.A11
A12  (via drill 0.35)
  Top 0.254: v181.61,12.7 U7.7 U7.6
  Bottom 0.254: U$1.A12 14.22,17.53 9.53,17.53 6.53,20.52 4.64,20.52 4.01,21.15 4.01,22.03 5.09,23.11 8.88,23.11 10.04,24.27 | 10.16,24.27 10.04,24.27 | 10.16,24.27 12.79,24.27 16.21,27.69 18.48,27.69 20.64,29.84 180.02,29.84 181.61,28.26 v181.61,12.7 | 10.04,24.27 10.16,24.27
A13  (via drill 0.35)
  Top 0.254: U7.8 U7.9 189.55,13.97 188.91,14.61 v182.88,14.61
  Bottom 0.254: 1.94,22.5 1.47,22.03 1.47,19.48 4.76,16.19 14.05,16.19 17.34,12.9 18.22,12.9 18.85,13.53 18.85,15.44 U$1.A13 | 1.94,22.5 2.1,22.66 | 1.94,22.5 4.17,24.73 12.6,24.73 16.02,28.14 18.28,28.14 20.31,30.17 20.39,30.25 180.89,30.25 182.88,28.26 v182.88,14.61
A14  (via drill 0.35)
  Top 0.254: U8.6 U8.7 v201.93,12.7 | U$1.A14 17.14,19.05 15.88,20.32 14.92,20.32 13.7,21.54 13.7,22.01 12.7,23.01 v12.7,26.67
  Bottom 0.254: v12.7,26.67 14.58,28.55 18.11,28.55 20.22,30.66 200.48,30.66 | v201.93,12.7 201.93,29.21 200.98,30.16 | 200.48,30.66 200.98,30.16 | 200.48,30.66 200.98,30.16
A15  (via drill 0.35)
  Top 0.254: U8.8 U8.9 212.56,14.2 211.29,14.2 210.88,14.61 v203.2,14.61 | U$1.26 26.67,15.24 26.67,17.46 26.35,17.78 14.61,17.78 13.97,18.41 13.97,19.68 13.34,20.32 12.38,20.32 11.43,21.27 v11.43,25.72
  Bottom 0.254: v11.43,25.72 11.43,26.67 13.72,28.96 17.94,28.96 20.05,31.06 200.65,31.06 202.56,29.15 202.56,15.24 v203.2,14.61
CV1
  Top 0.254: R7.2 18.73,103.19 17.78,104.14 12.21,104.14 J1.TIP
CV2
  Top 0.254: J2.TIP 27.01,104.14 33.02,104.14 33.97,103.19 R12.2
CV3
  Top 0.254: J3.TIP 41.13,102.73 42.55,104.14 48.26,104.14 49.21,103.19 R52.2
CV4
  Top 0.254: J4.TIP 57.49,104.14 63.5,104.14 64.45,103.19 R45.2
CV5
  Top 0.254: J5.TIP 71.61,102.73 73.03,104.14 78.42,104.14 79.69,102.87 R17.2
CV6
  Top 0.254: J6.TIP 87.97,104.14 93.98,104.14 94.93,103.19 94.93,102.55 R47.2
CV7
  Top 0.254: J7.TIP 103.21,104.14 109.22,104.14 110.17,103.19 R22.2
CV8
  Top 0.254: J8.TIP 118.11,103.8 118.11,104.14 124.46,104.14 125.41,103.19 R46.2
CV9
  Top 0.254: J9.TIP 132.28,103.07 133.35,104.14 139.7,104.14 140.65,103.19 R27.2
CV10
  Top 0.254: J10.TIP 148.93,104.14 154.94,104.14 155.89,103.19 R48.2
CV11
  Top 0.254: J11.TIP 164.17,104.14 170.18,104.14 171.13,103.19 R32.2
CV12
  Top 0.254: J12.TIP 178,103.07 179.07,104.14 185.74,104.14 186.37,103.5 R49.2
CV13
  Top 0.254: J13.TIP 194.65,104.14 200.66,104.14 201.61,103.19 R37.2
CV14
  Top 0.254: J14.TIP 208.48,103.07 209.55,104.14 215.9,104.14 216.85,103.19 R50.2
CV15
  Top 0.254: J15.TIP 223.72,103.07 224.79,104.14 230.5,104.14 232.09,102.55 R42.2
CV16
  Top 0.254: R51.2 245.11,96.52 243.84,97.79 243.84,101.6 242.71,102.73 J16.TIP
GND  (via drill 0.35)
  other vias: 189.23,26.67 178.75,12.38 84.77,21.27 88.9,17.14 130.81,16.83 124.78,26.67 193.68,16.83 214.95,16.83 173.04,16.83 152.08,16.83 68.26,16.83 63.82,20.32 50.48,13.34
  pour Bottom: 0,0 249,0 248.69,118.12 arc90 246.15,120.65 2.54,120.65 arc90 0,118.11
  pour Top: 0,-0.32 248.92,-0.32 248.92,118.11 arc90 246.38,120.65 2.54,120.65 arc90 0,118.11
MIDI_OUT
  Top 0.406: R2.2 222.25,12.38 221.3,11.43 221.3,8.57 221.3,8.26 219.39,6.67 41.59,6.67 40.96,6.67 38.1,3.81 31.75,3.81 10.16,3.81 U$1.1
N$1
  Bottom 0.254: JP1.TIP 228.28,20 226,17.72 226,6.78 S1.P2
N$2
  Bottom 0.254: 232.25,10 233.36,10 | 233.36,10 JP1.RING | S1.P1 226.67,4.71 227.65,3.73 228.47,3.73 229.24,4.5 229.24,8.89 229.87,9.53 230.34,10 233.36,10
N$3
  Top 0.254: S1.P2-TA 225.08,5.7 226.47,5.7 227.45,4.71 S1.P1-TB
  Top 0.406: S1.P2-TA 224.06,10.38 R2.1
N$4
  Top 0.406: S1.P2-TB 228.06,10.38 R1.1
  Bottom 0.254: S1.P1-TA 224.67,4.71 225.65,5.7 227.04,5.7 S1.P2-TB
N$6
  Top 0.254: R10.2 88.48,14.39 88.48,14.41 88.28,14.61 85.82,14.61 85.19,15.24 U2.5
  Top 0.406: R11.2 R10.2
N$7  (via drill 0.35)
  Top 0.254: v88.9,15.17 88.9,15.24 U2.10 | v90.49,16.51 R14.2
  Top 0.406: R14.2 R13.2
  Bottom 0.254: v88.9,15.17 89.14,15.17 v90.49,16.51
N$9
  Top 0.254: R5.2 68.26,12.38 67.53,13.12 67.53,14.41 67.34,14.6 62.78,14.6 62.14,15.24 U1.5
  Top 0.406: R5.2 R6.2
N$10  (via drill 0.35)
  Top 0.254: v69.53,16.51 R9.2 | v67.94,15.17 67.87,15.24 U1.10
  Top 0.406: R9.2 R8.2 | R8.2 72.07,18.1 | 72.07,18.1 72.39,17.78 72.07,18.1 | 72.07,18.1 R8.2
  Bottom 0.254: v67.94,15.17 68.19,15.17 v69.53,16.51
N$12
  Top 0.254: U3.5 104.46,15.24 105.09,14.61 106.68,14.61 | 106.68,14.61 107.95,14.61 | R15.2 110.17,12.38 109.54,13.02 109.54,14.29 109.22,14.61 106.68,14.61
  Top 0.406: R16.2 R15.2
N$13  (via drill 0.35)
  Top 0.254: U3.10 v109.86,15.24 | v111.44,16.19 R19.2
  Top 0.406: R19.2 R18.2
  Bottom 0.254: v109.86,15.24 110.81,16.19 v111.44,16.19
N$15
  Top 0.254: U4.5 125.73,15.24 126.36,14.61 130.18,14.61 131.13,13.65 131.13,12.7 131.44,12.38 131.76,12.38 R20.2
  Top 0.406: R20.2 R21.2
N$16  (via drill 0.35)
  Top 0.254: R23.2 R24.2 v132.4,15.88 | U4.10 v130.81,15.24
  Bottom 0.254: v130.81,15.24 131.76,15.24 v132.4,15.88
N$18
  Top 0.254: U5.5 147.64,15.24 148.27,14.61 151.13,14.61 151.76,13.97 151.76,12.7 152.08,12.38 152.09,12.38 R25.2
  Top 0.406: R25.2 R26.2
N$19  (via drill 0.35)
  Top 0.254: U5.10 v151.76,15.24 | v153.35,16.19 R29.2
  Top 0.406: R29.2 R28.2
  Bottom 0.254: v151.76,15.24 152.4,15.24 v153.35,16.19
N$21
  Top 0.254: U6.5 169.08,15.24 169.66,14.66 172.35,14.66 172.72,14.29 172.72,12.7 173.04,12.38 R30.2
  Top 0.406: R30.2 R31.2
N$22  (via drill 0.35)
  Top 0.254: U6.10 v172.72,15.24 | v174.44,16 174.31,16.13 R34.2
  Top 0.406: R34.2 R33.2
  Bottom 0.254: v172.72,15.24 173.67,15.24 v174.44,16
N$24
  Top 0.254: R35.2 193.99,12.38 193.68,12.7 193.68,14.29 193.36,14.61 193.04,14.61 192.98,14.66 190.61,14.66 190.03,15.24 U7.5
  Top 0.406: R36.2 R35.2
N$25  (via drill 0.35)
  Top 0.254: U7.10 v193.68,15.24 | v195.26,16.83 R39.2
  Top 0.406: R39.2 R38.2
  Bottom 0.254: v193.68,15.24 194.63,15.24 195.26,15.88 v195.26,16.83
N$27
  Top 0.254: U8.5 210.82,15.24 211.46,14.61 214,14.61 214.63,13.97 214.63,13.02 215.26,12.38 R40.2
  Top 0.406: R41.2 R40.2
N$28  (via drill 0.35)
  Top 0.254: U8.10 v214.63,15.24 | v216.22,16.19 R44.2
  Top 0.406: R44.2 R43.2
  Bottom 0.254: v214.63,15.24 215.26,15.24 v216.22,16.19
N$300
  Top 0.254: 60.96,23.5 60.8,23.65 | 60.8,23.65 59.09,25.36 14.96,25.36 14.37,25.95 14.37,96.28 16.83,98.74 R7.1 | U1.2 U1.1 60.9,23.55 60.8,23.65
N$301
  Top 0.254: R12.1 32.07,98.75 29.61,96.28 29.61,26.92 30.01,26.52 | 66.2,21.11 66.1,21 | 66.2,21.11 66.5,21.4 66.5,25.27 65.49,26.28 30.25,26.28 30.01,26.52 | 30.01,26.52 29.69,26.84 | U1.13 U1.14 66.1,21 | 66.1,21 66.2,21.11
N$302
  Top 0.254: R52.1 47.31,98.75 44.91,96.34 44.91,28.13 45.85,27.19 75.69,27.19 76.66,26.22 76.66,26.04 76.66,20.78 77.11,20.32 U2.1 U2.2
N$303
  Top 0.254: U2.13 U2.14 87.06,21.07 87.4,21.42 87.4,24.62 86.53,25.49 78.59,25.49 78.19,25.89 78.19,28.11 77.44,28.86 | 77.44,28.86 77.56,28.74 | 77.44,28.86 76.29,30.01 60.48,30.01 60.04,30.45 60.04,96.55 62.55,99.06 R45.1
N$304
  Top 0.254: U3.2 U3.1 101.37,21.76 101.37,30.01 100.5,30.89 76.52,30.89 75.28,32.13 75.28,96.52 77.79,99.03 77.79,99.06 R17.1
N$305
  Top 0.254: U3.13 U3.14 108.04,20.35 108.04,30.01 106.17,31.88 91.25,31.88 90.52,32.61 90.52,96.23 93.03,98.74 93.03,99.06 R47.1
N$306
  Top 0.254: U4.2 U4.1 123.77,28.95 121.6,31.11 121.57,31.09 119.55,33.11 106.94,33.11 105.76,34.29 105.76,96.23 108.27,98.74 R22.1
N$307
  Top 0.254: U4.13 U4.14 128.97,21.07 129.31,21.42 129.31,24.56 121.06,32.81 | R46.1 123.51,98.43 121.06,95.97 121.06,33.02 | 121.06,33.02 121.06,32.81 | 121.06,32.81 121.06,33.02
N$308
  Top 0.254: U5.2 U5.1 144.72,21.91 142.09,24.54 137.71,24.54 136.24,26.01 136.24,95.91 138.75,98.43 R27.1
N$309
  Top 0.254: U5.13 U5.14 149.92,21.33 151.48,22.89 151.48,95.91 153.99,98.42 R48.1
N$310
  Top 0.254: U6.2 U6.1 165.74,20.38 165.74,25.46 166.78,26.5 166.78,95.66 169.23,98.11 R32.1
N$311
  Top 0.254: U6.13 U6.14 171.13,20.58 171.13,25.4 171.13,30.16 173.27,32.3 173.99,32.3 180.19,32.3 181.96,34.06 181.96,34.61 181.96,95.57 181.96,95.6 184.47,98.11 R49.1
N$312
  Top 0.254: U7.2 U7.1 186.63,31.37 187.32,32.07 195.2,32.07 197.2,34.06 197.2,95.6 199.71,98.11 R37.1
N$313
  Top 0.254: U7.13 U7.14 192.49,20.98 192.49,26.99 | 192.49,26.99 192.49,27.3 | 192.49,26.99 192.49,29.99 193.21,30.71 205.91,30.71 212.44,37.24 212.44,95.6 214.95,98.11 R50.1
N$314
  Top 0.254: U8.2 U8.1 207.59,30.42 208.51,31.34 222.42,31.34 227.68,36.6 227.68,95.54 230.19,98.05 230.19,98.42 230.19,98.43 R42.1
N$315
  Top 0.254: U8.13 U8.14 212.72,20.38 212.72,21.59 214.86,23.72 240.52,23.72 242.98,26.18 242.98,85.5 245.11,87.63 R51.1
SCL  (via drill 0.35)
  Top 0.406: R4.1 44.45,22.54 45.09,23.18 45.1,23.16 D4.A 48.9,20.62 D3.C v48.9,18.41 48.9,16.19 45.48,12.78 JP2.RING
  Bottom 0.406: U$1.29 34.29,17.78 48.26,17.78 v48.9,18.41
SDA  (via drill 0.35)
  Top 0.406: R3.1 55.88,22.54 55.24,23.18 53.99,23.18 D2.A 53.98,22.55 D1.C 51.44,16.04 v53.42,14.05 55.48,11.99 JP2.TIP
  Bottom 0.406: v53.42,14.05 53.34,13.97 51.94,15.37 31.62,15.37 U$1.30
W0
  Top 0.254: R5.1 69.53,15.24 68.9,15.88 66.04,15.88 66.03,15.88 59.66,15.88 59.47,16.07 59.47,17.14 | 59.47,17.14 59.47,17.56 | U$17.2 13.91,25.72 14.72,24.91 57.96,24.91 59.47,23.4 59.47,18.1 | 59.47,18.1 59.47,17.14 | U1.3 59.79,17.78 59.47,18.1
W1
  Top 0.254: R9.1 68.27,20 68.26,20 67.94,19.68 67.94,18.1 67.63,17.78 U1.12 64.77,17.78 64.67,17.88 64.67,18.61 64.67,20.76 64.86,20.95 65.4,20.95 66.04,21.59 66.04,25.08 65.3,25.82 30.06,25.82 29.69,26.19 | 29.69,26.19 29.15,26.73 U$16.2 | 29.69,26.19 29.84,26.04
W2
  Top 0.254: 80.33,17.78 80.01,17.46 80.01,16.19 80.33,15.88 89.85,15.88 90.49,15.24 R10.1 | U$15.2 44.45,98.44 44.45,27.94 45.66,26.73 75.5,26.73 76.2,26.04 76.2,18.73 77.15,17.78 80.33,17.78 | 80.33,17.78 U2.3
W3
  Top 0.254: R14.1 89.22,20 88.9,19.68 88.9,18.41 88.27,17.78 U2.12 85.72,17.78 85.41,18.1 85.41,20.47 85.84,20.9 86.3,20.9 87,21.59 87,24.45 86.36,25.08 78.42,25.08 77.79,25.72 77.79,27.94 76.12,29.6 60.25,29.6 59.63,30.22 U$14.2
W4
  Top 0.254: R15.1 111.44,15.24 110.81,15.88 101.28,15.88 100.97,16.19 | 100.97,16.19 100.97,17.46 101.28,17.78 U3.3 | U$13.2 74.87,31.81 76.2,30.48 100.33,30.48 100.97,29.84 100.97,16.19
W5
  Top 0.254: R19.1 110.49,20 110.17,20 109.86,19.68 109.86,18.1 109.54,17.78 U3.12 107,17.78 106.63,18.15 106.63,20.74 107.63,21.74 107.63,29.84 106.05,31.43 91.12,31.43 90.11,32.45 U$12.2
W6
  Top 0.254: R20.1 132.08,14.6 132.08,15.24 131.44,15.88 131.13,15.88 131.07,15.93 122.56,15.93 | 122.56,15.93 122.55,15.93 | U4.3 122.56,17.78 122.24,17.46 | 122.24,17.46 122.24,16.24 122.55,15.93 | 122.55,15.93 122.56,15.93 | U$11.2 105.35,34.03 106.68,32.7 119.38,32.7 121.28,30.8 | 121.28,30.8 122.24,29.84 | 122.24,17.46 122.24,29.84 | 122.24,29.84 121.28,30.8
W7
  Top 0.254: R24.1 131.13,20 130.81,19.68 130.81,18.1 130.49,17.78 U4.12 127.64,17.78 127.32,18.1 127.32,20.64 127.95,21.27 128.59,21.27 128.91,21.59 128.91,23.81 | 128.91,23.81 128.91,24.13 | U$10.2 120.65,98.44 120.65,32.64 128.91,24.39 128.91,23.81
W8
  Top 0.254: U5.3 143.51,17.78 142.88,17.14 | 142.88,17.14 142.88,16.83 142.88,16.19 143.19,15.88 152.72,15.88 153.35,15.24 R25.1 | U$9.2 135.83,25.78 137.48,24.13 141.92,24.13 142.88,23.18 142.88,17.14
W9
  Top 0.254: R29.1 152.08,20 151.76,19.68 151.76,18.1 151.45,17.78 U5.12 148.59,17.78 148.27,18.1 148.27,20.95 148.91,21.59 149.6,21.59 151.07,23.06 U$8.2
W10
  Top 0.254: R30.1 174.31,15.24 173.62,15.93 164.46,15.93 163.88,16.51 163.83,16.51 163.83,17.14 | 163.83,17.14 163.83,17.46 164.15,17.78 U6.3 | U$7.2 166.37,98.44 166.37,26.67 163.83,24.13 163.83,17.14
W11
  Top 0.254: R34.1 173.36,20 173.35,20 172.72,19.37 172.72,18.1 172.4,17.78 U6.12 169.54,17.78 169.23,18.1 169.23,20.64 170.5,21.91 170.5,30.16 173.04,32.7 180.02,32.7 181.55,34.23 U$6.2
W12
  Top 0.254: 184.78,17.46 184.78,16.51 185.36,15.93 194.89,15.93 195.26,15.56 R35.1 | 184.78,17.46 185.1,17.78 U7.3 | U$5.2 196.79,34.23 195.03,32.47 187.1,32.47 184.78,30.16 184.78,17.46
W13
  Top 0.254: 192.09,17.78 U7.12 | 192.09,17.78 193.36,17.78 193.68,18.1 193.68,19.68 193.99,20 R39.1 | U$4.2 212.03,37.41 205.74,31.11 193.04,31.11 192.09,30.16 192.09,22.86 190.18,20.95 190.18,18.1 190.5,17.78 192.09,17.78
W14
  Top 0.254: U8.3 206.06,17.78 205.74,17.46 205.74,17.14 | R40.1 216.22,15.24 215.58,15.88 206.06,15.88 205.74,16.19 205.74,17.14 | U$3.2 227.27,36.77 227.17,36.67 222.25,31.75 208.28,31.75 205.74,29.21 205.74,17.14
W15
  Top 0.254: R44.1 214.95,20 214.63,19.68 214.63,18.1 214.31,17.78 U8.12 211.46,17.78 211.14,18.1 211.14,21.27 211.7,21.83 212.33,21.83 214.63,24.13 240.35,24.13 242.57,26.35 242.57,98.44 U$2.2

### Text on the board
tNames: MIDI | GND | SCL | SDA | 5V | 16 | (Korg, Makenoise, etc) | K | Tip is Out / Ring is +5V | II | K | A | I2C: Tip SDA, Ring SCL / DO NOT HOT PLUG | (Arturia, Novation, etc) | A | Tip is +5V / Ring is Out
bNames: 16 | Sean Hellfritsch / Brian Crabtree / Tom Armitage / Brendan Cassidy | v1.2 | (Korg, Makenoise, etc) | Tip is Out / Ring is +5V | K | K | A | (Arturia, Novation, etc) | Tip is +5V / Ring is Out | A